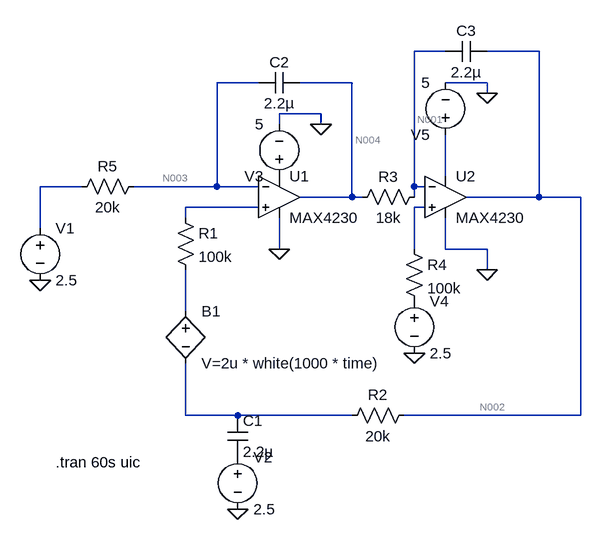
[diagram p0: schematic Draft1.asc]
Draft1.asc, the LTspice schematic file:
Version 4.1
SHEET 1 944 680
WIRE 464 -208 416 -208
WIRE 608 -208 528 -208
WIRE 176 -160 112 -160
WIRE 320 -160 240 -160
WIRE 528 -160 464 -160
WIRE 528 -144 528 -160
WIRE 272 -112 208 -112
WIRE 208 -96 208 -112
WIRE 272 -96 272 -112
WIRE 464 -16 464 -80
WIRE -96 0 -160 0
WIRE 112 0 112 -160
WIRE 112 0 -16 0
WIRE 176 0 112 0
WIRE 416 0 416 -208
WIRE 432 0 416 0
WIRE 320 16 320 -160
WIRE 320 16 240 16
WIRE 336 16 320 16
WIRE 416 16 416 0
WIRE 608 16 608 -208
WIRE 608 16 496 16
WIRE 672 16 608 16
WIRE 176 32 64 32
WIRE 432 32 416 32
WIRE 64 48 64 32
WIRE -160 64 -160 0
WIRE 208 96 208 48
WIRE 416 96 416 32
WIRE 464 96 464 48
WIRE 528 96 464 96
WIRE 528 128 528 96
WIRE 64 192 64 128
WIRE 64 352 64 272
WIRE 144 352 64 352
WIRE 320 352 144 352
WIRE 672 352 672 16
WIRE 672 352 400 352
FLAG 208 96 0
FLAG 528 128 0
FLAG 272 -96 0
FLAG 528 -144 0
FLAG -160 144 0
FLAG 144 496 0
FLAG 416 256 0
SYMBOL res 48 32 R0
SYMATTR InstName R1
SYMATTR Value 100k
SYMATTR SpiceLine tol=1 pwr=0.1
SYMBOL cap 128 352 R0
SYMATTR InstName C1
SYMATTR Value 2.2µ
SYMBOL res 416 336 R90
WINDOW 0 0 56 VBottom 2
WINDOW 3 32 56 VTop 2
SYMATTR InstName R2
SYMATTR Value 20k
SYMBOL res 432 0 R90
WINDOW 0 0 56 VBottom 2
WINDOW 3 32 56 VTop 2
SYMATTR InstName R3
SYMATTR Value 18k
SYMATTR SpiceLine tol=1 pwr=0.1
SYMBOL res 400 80 R0
SYMATTR InstName R4
SYMATTR Value 100k
SYMBOL cap 528 -224 R90
WINDOW 0 0 32 VBottom 2
WINDOW 3 32 32 VTop 2
SYMATTR InstName C3
SYMATTR Value 2.2µ
SYMATTR SpiceLine V=6.3 Irms=0 Rser=9 Lser=0
SYMBOL voltage 208 0 R180
WINDOW 123 0 0 Left 0
WINDOW 39 0 0 Left 0
SYMATTR InstName V3
SYMATTR Value 5
SYMBOL voltage 464 -64 R180
WINDOW 123 0 0 Left 0
WINDOW 39 0 0 Left 0
SYMATTR InstName V5
SYMATTR Value 5
SYMBOL cap 240 -176 R90
WINDOW 0 0 32 VBottom 2
WINDOW 3 32 32 VTop 2
SYMATTR InstName C2
SYMATTR Value 2.2µ
SYMATTR SpiceLine V=6.3 Irms=0 Rser=9 Lser=0
SYMBOL res 0 -16 R90
WINDOW 0 0 56 VBottom 2
WINDOW 3 32 56 VTop 2
SYMATTR InstName R5
SYMATTR Value 20k
SYMBOL voltage -160 48 R0
WINDOW 123 0 0 Left 0
WINDOW 39 0 0 Left 0
SYMATTR InstName V1
SYMATTR Value 2.5
SYMBOL voltage 144 400 R0
WINDOW 123 0 0 Left 0
WINDOW 39 0 0 Left 0
SYMATTR InstName V2
SYMATTR Value 2.5
SYMBOL voltage 416 160 R0
WINDOW 123 0 0 Left 0
WINDOW 39 0 0 Left 0
SYMATTR InstName V4
SYMATTR Value 2.5
SYMBOL bv 64 176 R0
SYMATTR InstName B1
SYMATTR Value V=2u * white(1000 * time)
SYMBOL OpAmps\\MAX4230 208 -48 R0
SYMATTR InstName U1
SYMBOL OpAmps\\MAX4230 464 -48 R0
SYMATTR InstName U2
TEXT -136 424 Left 2 !.tran 60s uic

The netlist it stands for:
* Draft1.asc
R1 N007 N009 100k tol=1 pwr=0.1
C1 N010 P001 2.2µ
R2 N002 N010 20k
R3 N001 N004 18k tol=1 pwr=0.1
R4 N008 P002 100k
C3 N002 N001 2.2µ V=6.3 Irms=0 Rser=9 Lser=0
V3 P003 0 5
V5 N005 0 5
C2 N004 N003 2.2µ V=6.3 Irms=0 Rser=9 Lser=0
R5 N003 N006 20k
V1 N006 0 2.5
V2 P001 0 2.5
V4 P002 0 2.5
B1 N009 N010 V=2u * white(1000 * time)
X§U1 N007 N003 P003 0 N004 MAX4230  ; pins In+ In- V+ V- OUT
X§U2 N008 N001 N005 0 N002 MAX4230  ; pins In+ In- V+ V- OUT
.tran 60s uic
.lib MAX4230.lib
.backanno
.end

* Results of the author's LTspice run, read from the files saved beside the schematic
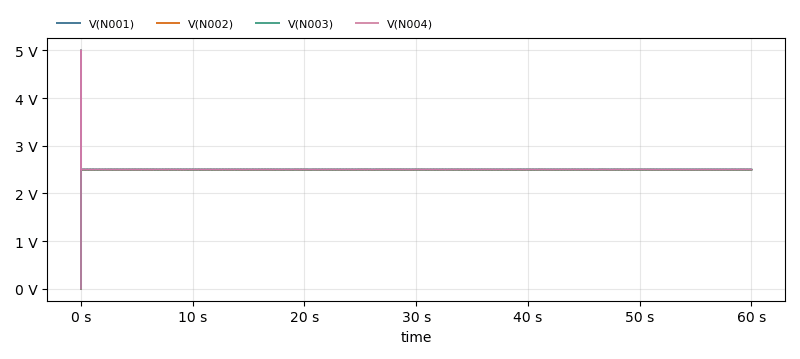
[diagram p1: Transient Analysis of Draft1.asc, plotted from the saved traces]
* Transient Analysis, 1 run:
*   V(N001): min 0 V, max 5 V, average 2.502 V, rms 2.502 V, last 2.502 V
*   V(N002): min 0 V, max 5 V, average 2.498 V, rms 2.498 V, last 2.496 V
*   V(N003): min 0 V, max 4.999 V, average 2.5 V, rms 2.5 V, last 2.499 V
*   V(N004): min 0 V, max 5 V, average 2.502 V, rms 2.502 V, last 2.501 V